# EAGLE design Driver control (EAGLE 9.5.2)
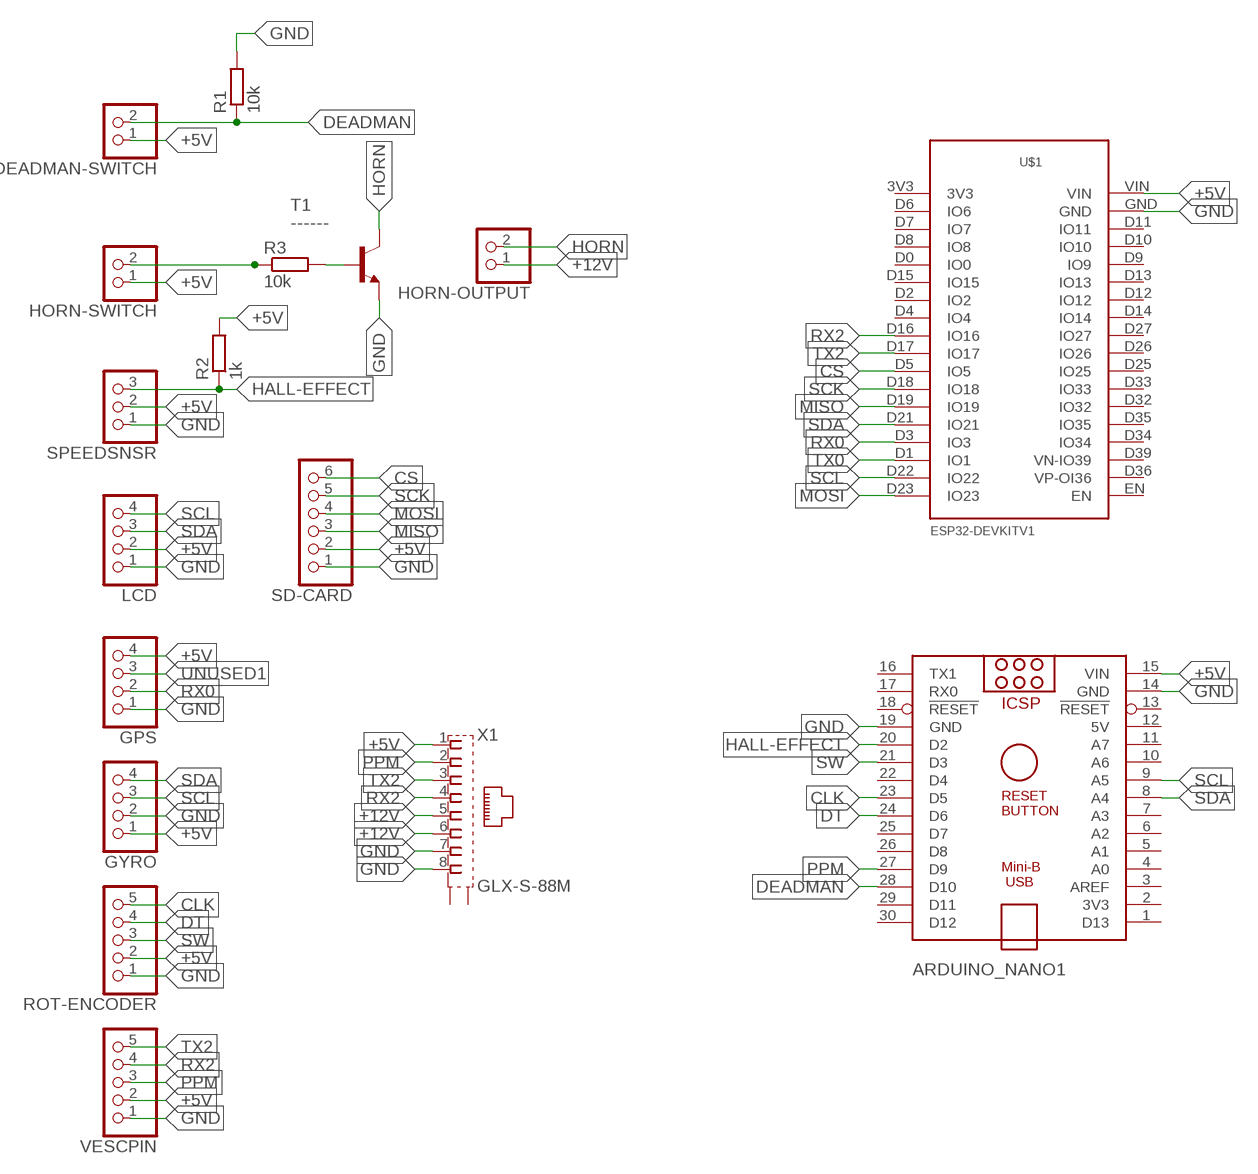
[diagram p0: schematic, sheet 1]

## Parts
ARDUINO_NANO1  ARDUINO_NANO  [ARDUINO_NANO]
DEADMAN-SWITCH  PINHD-1X2  [1X02]
GPS  PINHD-1X4  [1X04]
GYRO  PINHD-1X4  [1X04]
HORN-OUTPUT  PINHD-1X2  [1X02]
HORN-SWITCH  PINHD-1X2  [1X02]
LCD  PINHD-1X4  [1X04]
R1  10k  R-EU_0204/7  [0204/7]
R2  1k  R-EU_0204/7  [0204/7]
R3  10k  R-EU_0204/7  [0204/7]
ROT-ENCODER  PINHD-1X5  [1X05]
SD-CARD  PINHD-1X6  [1X06]
SPEEDSNSR  PINHD-1X3  [1X03]
T1  ------  2N2219  [TO5]
U$1  ESP32DEVKITV1  [ESP32-DEVKITV1]
VESCPIN  PINHD-1X5  [1X05]
X1  GLX-S-88M  [GLX-S-88M]

## Nets
+5V: ARDUINO_NANO1.15(VIN) DEADMAN-SWITCH.1 GPS.4 GYRO.1 HORN-SWITCH.1 LCD.2 R2.2 ROT-ENCODER.2 SD-CARD.2 SPEEDSNSR.2 U$1.VIN VESCPIN.2 X1.1
+12V [+12v]: HORN-OUTPUT.1 X1.5 X1.6
CLK: ARDUINO_NANO1.23(D5) ROT-ENCODER.5
CS: SD-CARD.6 U$1.D5(IO5)
DEADMAN: ARDUINO_NANO1.28(D10) DEADMAN-SWITCH.2 R1.1
DT: ARDUINO_NANO1.24(D6) ROT-ENCODER.4
GND: ARDUINO_NANO1.14(GND) ARDUINO_NANO1.19(GND) GPS.1 GYRO.2 LCD.1 R1.2 ROT-ENCODER.1 SD-CARD.1 SPEEDSNSR.1 T1.1(E) U$1.GND VESCPIN.1 X1.7 X1.8
HALL-EFFECT: ARDUINO_NANO1.20(D2) R2.1 SPEEDSNSR.3
HORN: HORN-OUTPUT.2 T1.3(C)
MISO: SD-CARD.3 U$1.D19(IO19)
MOSI: SD-CARD.4 U$1.D23(IO23)
N$1: HORN-SWITCH.2 R3.1
N$2: R3.2 T1.2(B)
PPM: ARDUINO_NANO1.27(D9) VESCPIN.3 X1.2
RX0: GPS.2 U$1.D3(IO3)
RX2: U$1.D16(IO16) VESCPIN.4 X1.4
SCK: SD-CARD.5 U$1.D18(IO18)
SCL: ARDUINO_NANO1.9(A5) GYRO.3 LCD.4 U$1.D22(IO22)
SDA: ARDUINO_NANO1.8(A4) GYRO.4 LCD.3 U$1.D21(IO21)
SW: ARDUINO_NANO1.21(D3) ROT-ENCODER.3
TX0: U$1.D1(IO1)
TX2: U$1.D17(IO17) VESCPIN.5 X1.3
UNUSED1: GPS.3
Unconnected: ARDUINO_NANO1.1(D13) ARDUINO_NANO1.2(3V3) ARDUINO_NANO1.3(AREF) ARDUINO_NANO1.4(A0) ARDUINO_NANO1.5(A1) ARDUINO_NANO1.6(A2) ARDUINO_NANO1.7(A3) ARDUINO_NANO1.10(A6) ARDUINO_NANO1.11(A7) ARDUINO_NANO1.13(!RESET) ARDUINO_NANO1.16(TX1) ARDUINO_NANO1.17(RX0) ARDUINO_NANO1.18(!RESET) ARDUINO_NANO1.22(D4) ARDUINO_NANO1.25(D7) ARDUINO_NANO1.26(D8) ARDUINO_NANO1.29(D11) ARDUINO_NANO1.30(D12) U$1.3V3 U$1.D0(IO0) U$1.D2(IO2) U$1.D4(IO4) U$1.D6(IO6) U$1.D7(IO7) U$1.D8(IO8) U$1.D9(IO9) U$1.D10(IO10) U$1.D11(IO11) U$1.D12(IO12) U$1.D13(IO13) U$1.D14(IO14) U$1.D15(IO15) U$1.D25(IO25) U$1.D26(IO26) U$1.D27(IO27) U$1.D32(IO32) U$1.D33(IO33) U$1.D34(IO34) U$1.D35(IO35) U$1.D36(VP-OI36) U$1.D39(VN-IO39) U$1.EN X1.S1 X1.S2

## Power pins joined to a net without a drawn wire
5V: ARDUINO_NANO1.12(5V)

## Library data of the parts
ARDUINO_NANO1 = ArduinoNanoV30:ARDUINO_NANO: Arduino Nano V3.0 Overview: The Arduino Nano is a small, complete, and breadboard-friendly board based on the ATmega328 (Arduino Nano 3.x) or ATmega168 (Arduino Nano 2.x). It has more or less the same functionality of the Arduino Duemilanove, but in a different package. It lacks only a DC power jack, and works with a Mini-B USB cable instead of a standard one. The Nano was designed and is being produced by Gravitech. Specifications: Microcontroller Atmel ATmega168 or ATmega328 Operating Voltage (logic level) 5 V Input Voltage (recommended) 7-12 V Input Voltage (limits) 6-20 V Digital I/O Pins 14 (of which 6 provide PWM output) Analog Input Pins 8 DC Current per I/O Pin 40 mA Flash Memory 16 KB (ATmega168) or 32 KB (ATmega328) of which 2 KB used by bootloader SRAM 1 KB (ATmega168) or 2 KB (ATmega328) EEPROM 512 bytes (ATmega168) or 1 KB (ATmega328) Clock Speed 16 MHz Dimensions 0.73" x 1.70" Length 45 mm Width 18 mm Weigth 5 g Power: The Arduino Nano can be powered via the Mini-B USB connection, 6-20V unregulated external power supply (pin 30), or 5V regulated external power supply (pin 27). The power source is automatically selected to the highest voltage source. Memory: The ATmega168 has 16 KB of flash memory for storing code (of which 2 KB is used for the bootloader); the ATmega328 has 32 KB, (also with 2 KB used for the bootloader). The ATmega168 has 1 KB of SRAM and 512 bytes of EEPROM (which can be read and written with the EEPROM library); the ATmega328 has 2 KB of SRAM and 1 KB of EEPROM. Input and Output: Each of the 14 digital pins on the Nano can be used as an input or output, using pinMode(), digitalWrite(), and digitalRead() functions. They operate at 5 volts. Each pin can provide or receive a maximum of 40 mA and has an internal pull-up resistor (disconnected by default) of 20-50 kOhms. In addition, some pins have specialized functions. Visit Arduino - ArduinoBoardNano <https://www.arduino.cc/en/Main/ArduinoBoardNano>
DEADMAN-SWITCH HORN-OUTPUT HORN-SWITCH = pinhead:PINHD-1X2: PIN HEADER
GPS GYRO LCD = pinhead:PINHD-1X4: PIN HEADER
R1-R3 = rcl:R-EU_: RESISTOR, European symbol; SPICEPREFIX: R
ROT-ENCODER VESCPIN = pinhead:PINHD-1X5: PIN HEADER
SD-CARD = pinhead:PINHD-1X6: PIN HEADER
SPEEDSNSR = pinhead:PINHD-1X3: PIN HEADER
T1 = transistor:2N2219: NPN TRANSISTOR
U$1 = ESP32-DEVKITV1:ESP32DEVKITV1
X1 = con-kycon:GLX-S-88M: Mod. Jack, Right Angle, 8 posiotion, 8 contatcs RJ45 Source: GLX-S-88M.pdf; OC_FARNELL: unknown; OC_NEWARK: unknown

## Net classes
1 +12v: width 1 mm

## Board
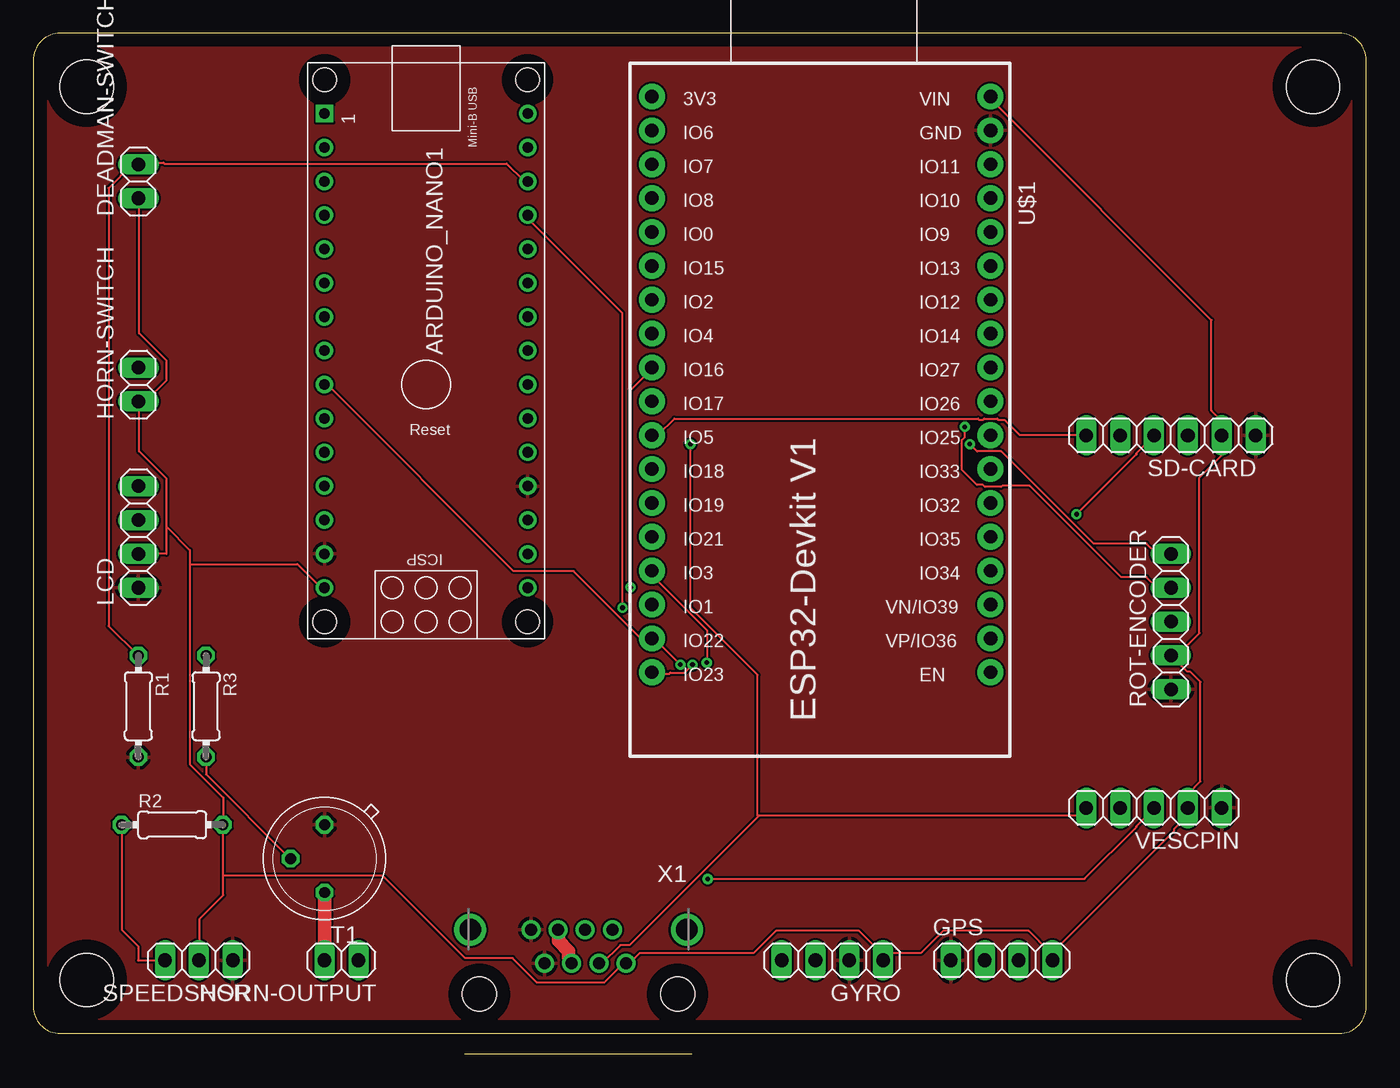
[diagram p1: board, top side]
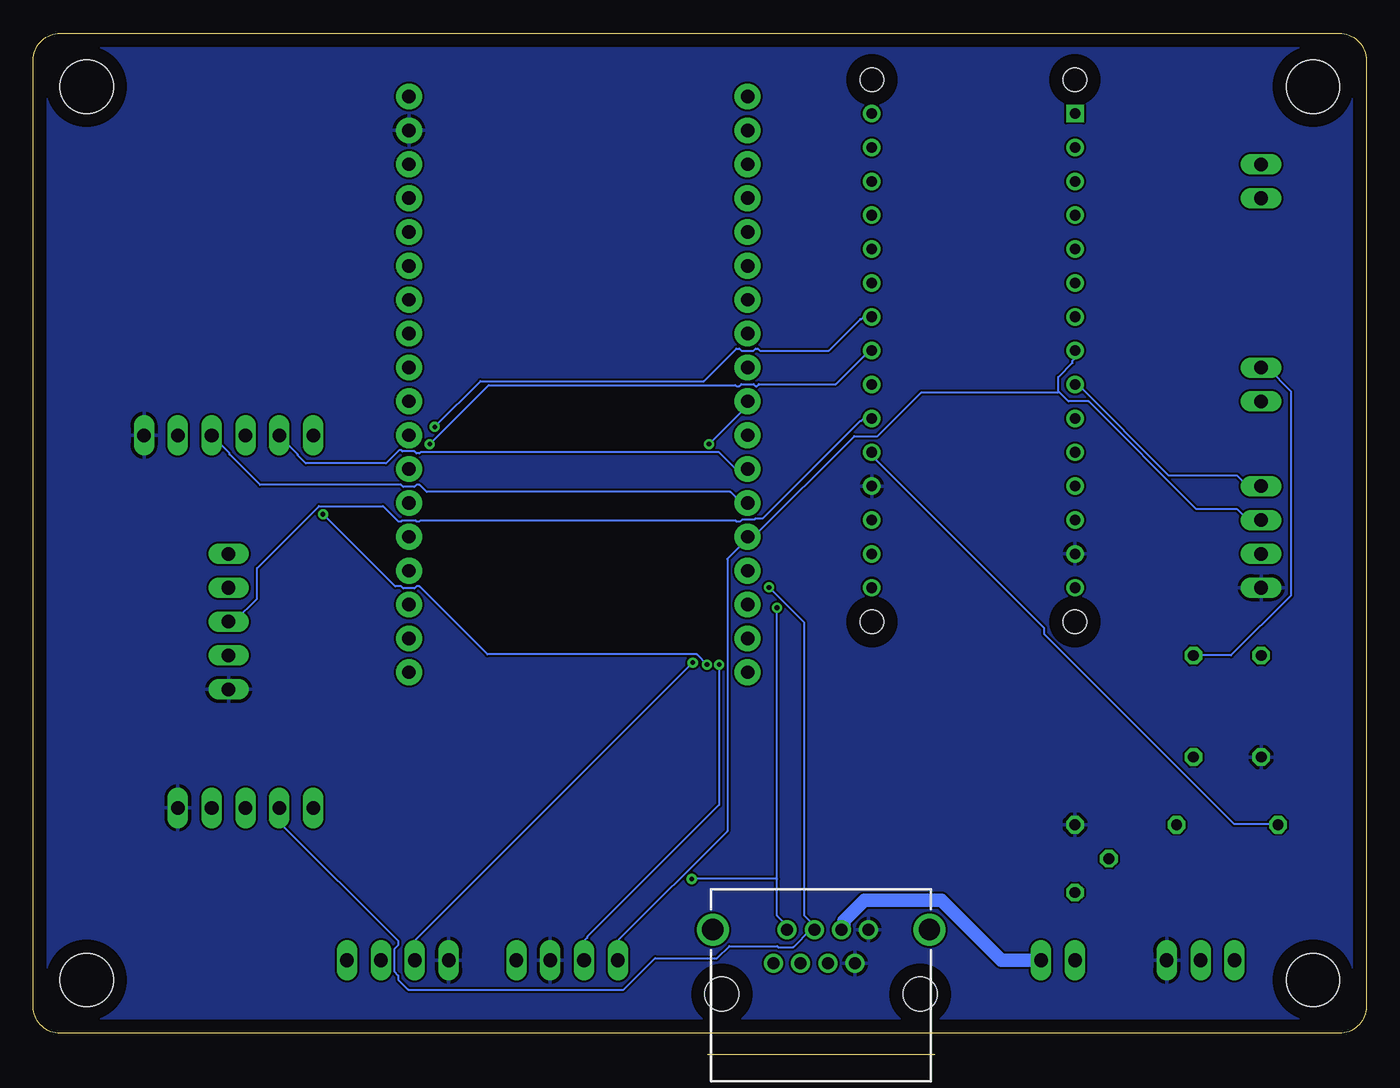
[diagram p2: board, bottom side, seen from below]

Size 100 x 75 mm. Coordinates in mm from the lower left corner, seen from the top.
Outline: 2,75 arc90 0,73 0,2 arc90 2,0 98,0 arc90 100,2 100,73 arc90 98,75 2,75
Copper layers (1*16): Top 0.035mm / dielectric 1.5mm / Bottom 0.035mm
Design rules "default": minimum track width 6mil, minimum drill 0.35mm, track to track 6mil, track to pad 6mil, pad to pad 6mil, via to via 6mil, smd to smd 6mil, copper to edge 40mil, drill to drill 6mil, minimum pad ring 10mil, minimum via ring 8mil, stop-mask expansion 4mil, vias tented up to drill 0mil, thermal gap 10mil
Holes 4 mm at 4,71 96,71 96,4 4,4

### Footprints (pad centres in the part's own frame; a part is rotated, then mirrored left to right if it is on the bottom)
ARDUINO_NANO = drill 0.8 square: 1 -20.32,-7.62 | drill 0.8: 2 -17.78,-7.62; 3 -15.24,-7.62; 4 -12.7,-7.62; 5 -10.16,-7.62; 6 -7.62,-7.62; 7 -5.08,-7.62; 8 -2.54,-7.62; 9 0,-7.62; 10 2.54,-7.62; 11 5.08,-7.62; 12 7.62,-7.62; 13 10.16,-7.62; 14 12.7,-7.62; 15 15.24,-7.62; 16 15.24,7.62; 17 12.7,7.62; 18 10.16,7.62; 19 7.62,7.62; 20 5.08,7.62; 21 2.54,7.62; 22 0,7.62; 23 -2.54,7.62; 24 -5.08,7.62; 25 -7.62,7.62; 26 -10.16,7.62; 27 -12.7,7.62; 28 -15.24,7.62; 29 -17.78,7.62; 30 -20.32,7.62 | hole 1.778: -22.86,-7.62; -22.86,7.62; 17.78,7.62; 17.78,-7.62
1X02 = drill 1.016 long: 1 -1.27,0; 2 1.27,0
1X04 = drill 1.016 long: 1 -3.81,0; 2 -1.27,0; 3 1.27,0; 4 3.81,0
0204/7 = drill 0.813 octagon: 1 -3.81,0; 2 3.81,0
1X05 = drill 1.016 long: 1 -5.08,0; 2 -2.54,0; 3 0,0; 4 2.54,0; 5 5.08,0
1X06 = drill 1.016 long: 1 -6.35,0; 2 -3.81,0; 3 -1.27,0; 4 1.27,0; 5 3.81,0; 6 6.35,0
1X03 = drill 1.016 long: 1 -2.54,0; 2 0,0; 3 2.54,0
TO5 = drill 0.813 octagon: 1 0,-2.54; 2 2.54,0; 3 0,2.54
ESP32-DEVKITV1 = drill 1 pad 1.93: 3V3 -24.14,-12.27; D0 -13.98,-12.27; D1 13.96,-12.27; D2 -8.9,-12.27; D3 11.42,-12.27; D4 -6.36,-12.27; D5 1.26,-12.27; D6 -21.6,-12.27; D7 -19.06,-12.27; D8 -16.52,-12.27; D9 -13.98,13.135; D10 -16.52,13.135; D11 -19.06,13.135; D12 -8.9,13.135; D13 -11.44,13.135; D14 -6.36,13.135; D15 -11.44,-12.27; D16 -3.82,-12.27; D17 -1.28,-12.27; D18 3.8,-12.27; D19 6.34,-12.27; D21 8.88,-12.27; D22 16.5,-12.27; D23 19.04,-12.27; D25 1.26,13.135; D26 -1.28,13.135; D27 -3.82,13.135; D32 6.34,13.135; D33 3.8,13.135; D34 11.42,13.135; D35 8.88,13.135; D36 16.5,13.135; D39 13.96,13.135; EN 19.04,13.135; GND -21.6,13.135; VIN -24.14,13.135
GLX-S-88M = drill 0.9 pad 1.422: 1 -3.57,-2.3; 2 -2.55,-4.84; 3 -1.53,-2.3; 4 -0.51,-4.84; 5 0.51,-2.3; 6 1.53,-4.84; 7 2.55,-2.3; 8 3.57,-4.84 | drill 1.6 pad 2.184: S1 -8.125,-4.84; S2 8.125,-4.84 | hole 2.55: -7.44,0; 7.44,0

### Placement (x,y rotation side)
ARDUINO_NANO1  29.47,48.66 270 top
DEADMAN-SWITCH  7.88,63.9 90 top
GPS  72.65,5.48 0 top
GYRO  59.95,5.48 180 top
HORN-OUTPUT  23.12,5.48 180 top
HORN-SWITCH  7.88,48.66 90 top
LCD  7.88,37.23 90 top
R1  7.88,24.53 270 top
R2  10.42,15.64 0 top
R3  12.96,24.53 270 top
ROT-ENCODER  85.35,30.88 90 top
SD-CARD  85.35,44.85 180 top
SPEEDSNSR  12.42,5.48 180 top
T1  21.85,13.1 180 top
U$1  58.68,46.12 270 top
VESCPIN  84.08,16.91 180 top
X1  40.9,2.94 180 top

### Tracks (layer width: path | path; a pad name or v marks a point on that pad's centre or on a via)
+5V
  Top 0.152: 14.26,11.8 14.26,10.36 12.45,8.55 12.45,5.5 SPEEDSNSR.2 | 14.26,11.8 14.26,15.62 R2.2 14.26,15.69 14.26,17.67 11.74,20.19 11.74,35.2 | 11.74,35.2 19.82,35.2 21.57,33.45 21.8,33.45 ARDUINO_NANO1.15 | 7.93,47.39 7.93,43.66 9.99,41.6 9.99,38 | 9.99,38 9.99,35.96 LCD.2 | 7.93,47.39 8.39,47.39 9.99,48.99 9.99,50.44 7.93,52.5 7.93,62.63 DEADMAN-SWITCH.1 | 7.93,47.39 HORN-SWITCH.1 | 85.58,28.11 86.57,27.12 86.8,27.12 87.56,26.36 87.56,18.89 86.65,17.98 86.65,16.91 VESCPIN.2 86.57,16.91 86.57,16.3 85.58,15.31 85.58,15.16 76.51,6.09 76.51,5.48 GPS.4 76.51,6.17 76.21,6.17 74.68,7.69 68.28,7.69 66.61,6.01 63.71,6.01 GYRO.1 63.71,5.48 63.71,5.94 61.96,7.69 55.71,7.69 54.03,6.01 45.5,6.01 44.73,5.25 44.51,5.25 X1.1 44.43,5.18 44.2,5.18 42.83,3.8 37.8,3.8 35.97,5.63 32.39,5.63 26.22,11.8 14.26,11.8 | 85.58,28.11 87.48,30.02 87.48,41.67 89.16,43.35 SD-CARD.2 89.16,45.94 88.4,46.7 88.4,53.49 71.86,70.02 71.86,70.25 U$1.VIN | 85.58,28.11 ROT-ENCODER.2 | 9.99,38 11.74,36.25 11.74,35.2
+12V
  Top 1: X1.5 40.32,5.25 40.32,5.56 40.16,5.71 40.16,6.17 39.4,6.93 39.4,7.46 39.33,7.54 39.33,7.77 X1.6
  Bottom 1: HORN-OUTPUT.1 27.36,5.48 31.86,9.98 37.65,9.98 39.17,8.45 39.17,8.07 39.4,7.84 X1.6
CLK  (via drill 0.35)
  Top 0.152: v70.26,44.19 70.8,43.66 72.62,43.66 79.56,36.72 83.52,36.72 84.28,35.96 ROT-ENCODER.5
  Bottom 0.152: ARDUINO_NANO1.23 37.27,51.2 39.78,48.69 45.57,48.69 45.73,48.53 45.8,48.53 45.95,48.69 46.87,48.69 47.02,48.53 47.25,48.53 47.33,48.61 65.84,48.61 v70.26,44.19
CS
  Top 0.152: SD-CARD.6 78.95,44.88 74,44.88 72.85,46.02 72.4,46.02 72.32,46.09 71.33,46.09 71.25,46.02 70.95,46.02 70.87,46.09 48.09,46.09 46.87,44.88 46.41,44.88 U$1.D5
DEADMAN
  Top 0.152: ARDUINO_NANO1.28 37.04,63.92 36.81,63.92 35.52,65.22 9.84,65.22 9.76,65.3 8.01,65.3 DEADMAN-SWITCH.2 7.85,65.14 7.4,65.14 5.65,63.39 5.65,30.55 7.85,28.34 R1.1
DT  (via drill 0.35)
  Top 0.152: v69.88,45.48 69.88,44.72 69.65,44.49 69.65,42.28 70.8,41.14 71.25,41.14 71.41,40.99 72.62,40.99 72.7,41.06 74.76,41.06 81.62,34.21 83.52,34.21 84.28,33.45 85.35,33.45 ROT-ENCODER.4
  Bottom 0.152: v69.88,45.48 66.45,48.91 49.69,48.91 47.25,51.35 47.02,51.35 46.87,51.2 45.95,51.2 45.8,51.35 45.65,51.35 45.5,51.2 40.32,51.2 37.95,53.56 37.88,53.56 37.72,53.72 37.11,53.72 ARDUINO_NANO1.24
GND
  pour Top: -64.51,112.16 -64.51,-38.97 119.64,-38.97 119.64,115.97
  pour Bottom: -61.97,109.62 -61.97,-30.08 115.83,-30.08 115.83,105.81 -59.43,105.81 -59.43,107.08
HALL-EFFECT
  Top 0.152: SPEEDSNSR.3 7.85,5.48 7.85,6.55 6.63,7.77 6.63,15.62 R2.1
  Bottom 0.152: ARDUINO_NANO1.20 37.04,43.58 37.04,43.28 24.16,30.4 24.16,29.94 9.91,15.69 6.63,15.69 R2.1
HORN
  Top 1: HORN-OUTPUT.2 T1.3
MISO
  Bottom 0.152: SD-CARD.3 85.27,43.5 85.27,43.43 82.99,41.14 72.4,41.14 72.24,40.99 71.41,40.99 71.25,41.14 71.02,41.14 70.49,40.61 47.71,40.61 46.94,39.85 46.41,39.85 U$1.D19
MOSI  (via drill 0.35)
  Top 0.152: v78.26,38.93 82.76,43.43 82.76,43.5 84.06,44.8 SD-CARD.4 | v49.46,27.65 48.85,27.05 47.78,27.05 47.71,26.97 47.4,26.97 47.33,27.05 46.41,27.05 U$1.D23
  Bottom 0.152: v78.26,38.93 72.85,33.52 72.4,33.52 72.24,33.37 71.41,33.37 71.25,33.52 71.02,33.52 65.92,28.42 50.22,28.42 v49.46,27.65
N$1
  Bottom 0.152: R3.1 10.14,28.34 5.65,32.84 5.65,48.15 7.4,49.91 7.85,49.91 HORN-SWITCH.2
N$2
  Top 0.152: R3.2 12.96,19.42 19.28,13.1 T1.2
PPM  (via drill 0.35)
  Top 0.152: v44.2,31.92 44.2,54.02 37.11,61.11 37.11,61.33 ARDUINO_NANO1.27 | v50.6,11.58 78.87,11.58 82.76,15.46 82.76,15.54 83.44,16.22 83.44,16.3 84.06,16.91 VESCPIN.3
  Bottom 0.152: 44.2,11.58 44.2,8.83 43.52,8.15 43.52,7.84 X1.2 | 44.2,11.58 v44.2,31.92 | 44.2,11.58 v50.6,11.58
RX0  (via drill 0.35)
  Top 0.152: v50.53,27.81 50.53,30.24 46.41,34.36 46.41,34.66 U$1.D3
  Bottom 0.152: v50.53,27.81 71.33,7 71.33,5.48 GPS.2
RX2  (via drill 0.35)
  Top 0.152: v44.81,33.45 44.81,48.23 46.34,49.75 46.34,49.91 U$1.D16
  Bottom 0.152: 41.69,7.77 41.46,7.77 X1.4 41.69,7.77 | 41.69,7.77 42.98,6.47 44.13,6.47 44.2,6.55 47.78,6.55 48.7,5.63 53.35,5.63 55.71,3.27 71.86,3.27 72.62,4.03 72.62,4.34 72.93,4.64 72.93,6.32 72.62,6.62 72.62,6.93 81.54,15.84 VESCPIN.4 | v44.81,33.45 42.14,30.78 42.14,8.83 41.69,8.38 41.69,7.77
SCK
  Bottom 0.152: SD-CARD.5 81.54,44.8 80.17,43.43 80.17,43.35 79.56,42.74 73.54,42.74 72.55,43.73 72.4,43.73 72.32,43.66 71.41,43.66 71.25,43.5 71.02,43.5 70.95,43.58 48.55,43.58 47.33,42.36 46.41,42.36 U$1.D18
SCL  (via drill 0.35)
  Top 0.152: v48.55,27.65 46.64,29.56 46.41,29.56 U$1.D22 46.34,29.63 45.57,29.63 40.54,34.66 36.05,34.66 22.1,48.61 21.88,48.61 ARDUINO_NANO1.9
  Bottom 0.152: ARDUINO_NANO1.9 21.8,48.61 21.57,48.61 14.79,41.83 9.68,41.83 8.92,41.06 7.93,41.06 LCD.4 | GYRO.3 58.68,6.93 58.45,7.16 58.45,7.23 48.55,17.14 v48.55,27.65
SDA
  Bottom 0.152: 23.06,48.11 22.33,47.39 20.81,47.39 12.73,39.31 9.68,39.31 8.92,38.55 7.93,38.55 LCD.3 | 23.06,48.11 23.09,48.15 23.09,49.22 22.03,50.29 22.03,50.44 21.88,50.59 21.88,51.2 ARDUINO_NANO1.8 | GYRO.4 56.09,5.48 56.09,7 47.94,15.16 47.94,35.58 46.34,37.18 U$1.D21 46.26,37.18 46.03,37.18 38.41,44.8 36.66,44.8 33.38,48.08 23.09,48.08 23.06,48.11
SW
  Bottom 0.152: ARDUINO_NANO1.21 37.11,46.09 37.72,46.09 37.88,45.94 37.95,45.94 45.27,38.63 45.8,38.63 45.88,38.55 46.79,38.55 46.94,38.4 47.25,38.4 47.33,38.48 70.95,38.48 71.02,38.4 71.25,38.4 71.33,38.48 72.32,38.48 72.4,38.4 72.62,38.4 73.77,39.54 78.57,39.54 83.22,34.89 83.22,32.61 84.89,30.93 85.35,30.93 ROT-ENCODER.3
TX2  (via drill 0.35)
  Top 0.152: 54.38,16.26 54.41,16.3 78.34,16.3 78.95,16.91 VESCPIN.5 | 54.38,16.26 44.73,6.62 44.05,6.62 42.68,5.25 42.45,5.25 X1.3 | v49.31,44.19 49.31,31.92 54.34,26.89 54.34,16.3 54.38,16.26
  Bottom 0.152: v49.31,44.19 46.41,47.08 U$1.D17

### Text on the board
Reference: SEM 2020 / Girton Grammar School